# EAGLE design BLDC_Motor_Controller_ADP3120A (EAGLE 9.1.3)
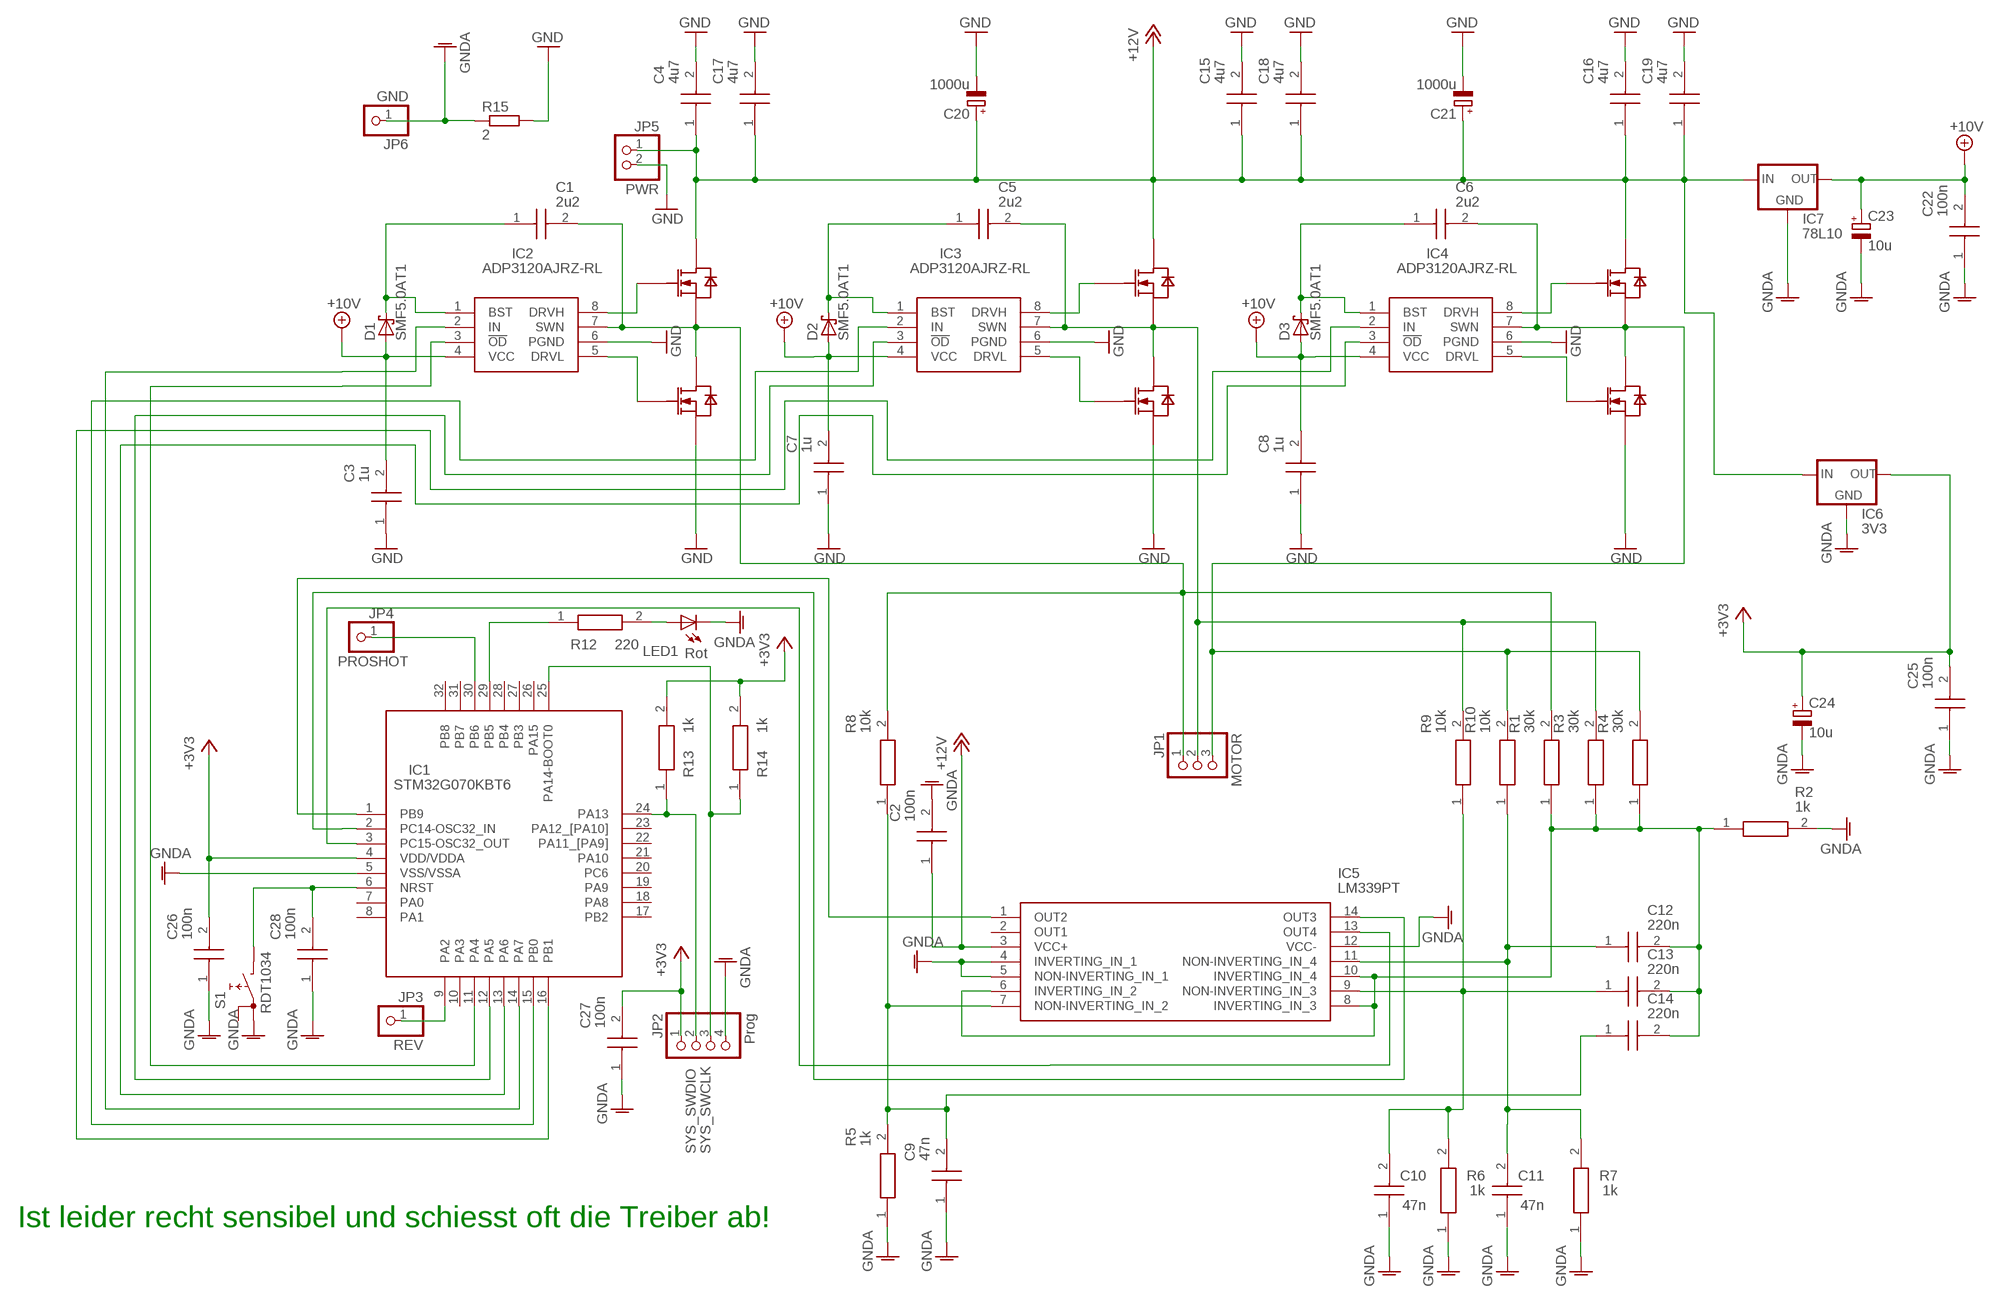
[diagram p0: schematic, sheet 1]

## Parts
C1  2u2  CL21B225KAFNNNE  [CAPC2012X135N]
C2  100n  C2012X7T2E104M125AE  [CAPC2012X145N]
C3  1u  GRM31CC72A475KE11K  [GRM31X]
C4  4u7  GRM31CC72A475KE11K  [GRM31X]
C5  2u2  CL21B225KAFNNNE  [CAPC2012X135N]
C6  2u2  CL21B225KAFNNNE  [CAPC2012X135N]
C7  1u  GRM31CC72A475KE11K  [GRM31X]
C8  1u  GRM31CC72A475KE11K  [GRM31X]
C9  47n  C2012X7T2E104M125AE  [CAPC2012X145N]
C10  47n  C2012X7T2E104M125AE  [CAPC2012X145N]
C11  47n  C2012X7T2E104M125AE  [CAPC2012X145N]
C12  220n  C2012X7T2E104M125AE  [CAPC2012X145N]
C13  220n  C2012X7T2E104M125AE  [CAPC2012X145N]
C14  220n  C2012X7T2E104M125AE  [CAPC2012X145N]
C15  4u7  GRM31CC72A475KE11K  [GRM31X]
C16  4u7  GRM31CC72A475KE11K  [GRM31X]
C17  4u7  GRM31CC72A475KE11K  [GRM31X]
C18  4u7  GRM31CC72A475KE11K  [GRM31X]
C19  4u7  GRM31CC72A475KE11K  [GRM31X]
C20  1000u  CPOL-EU150CLZ-0810  [150CLZ-0810]
C21  1000u  CPOL-EU150CLZ-0810  [150CLZ-0810]
C22  100n  C2012X7T2E104M125AE  [CAPC2012X145N]
C23  10u  CPOL-EUSMCC  [SMC_C]
C24  10u  CPOL-EUSMCC  [SMC_C]
C25  100n  C2012X7T2E104M125AE  [CAPC2012X145N]
C26  100n  C2012X7T2E104M125AE  [CAPC2012X145N]
C27  100n  C2012X7T2E104M125AE  [CAPC2012X145N]
C28  100n  C2012X7T2E104M125AE  [CAPC2012X145N]
D1  SMF5.0AT1  [SOD123FL]
D2  SMF5.0AT1  [SOD123FL]
D3  SMF5.0AT1  [SOD123FL]
IC1  STM32G070KBT6  [QFP80P900X900X160-32N]
IC2  ADP3120AJRZ-RL  [SOIC127P600X175-8N]
IC3  ADP3120AJRZ-RL  [SOIC127P600X175-8N]
IC4  ADP3120AJRZ-RL  [SOIC127P600X175-8N]
IC5  LM339PT  [SOP65P640X120-14N]
IC6  3V3  XC63FPP  [SOT89R]
IC7  78L10  XC63FPP  [SOT89R]
JP1  MOTOR  PINHD-1X3  [1X03]
JP2  Prog  PINHD-1X4  [1X04]
JP3  REV  PINHD-1X1  [1X01]
JP4  PROSHOT  PINHD-1X1  [1X01]
JP5  PWR  PINHD-1X2  [1X02]
JP6  GND  PINHD-1X1  [1X01]
LED1  Rot  LEDSML0805  [SML0805]
Q1  IRFR1205TRPBF  [TO229P991X239-3_4N]
Q2  IRFR1205TRPBF  [TO229P991X239-3_4N]
Q3  IRFR1205TRPBF  [TO229P991X239-3_4N]
Q4  IRFR1205TRPBF  [TO229P991X239-3_4N]
Q5  IRFR1205TRPBF  [TO229P991X239-3_4N]
Q6  IRFR1205TRPBF  [TO229P991X239-3_4N]
R1  30k  ERJ-UP6F1180V  [ERJUP6]
R2  1k  ERJ-UP6F1180V  [ERJUP6]
R3  30k  ERJ-UP6F1180V  [ERJUP6]
R4  30k  ERJ-UP6F1180V  [ERJUP6]
R5  1k  ERJ-UP6F1180V  [ERJUP6]
R6  1k  ERJ-UP6F1180V  [ERJUP6]
R7  1k  ERJ-UP6F1180V  [ERJUP6]
R8  10k  ERJ-UP6F1180V  [ERJUP6]
R9  10k  ERJ-UP6F1180V  [ERJUP6]
R10  10k  ERJ-UP6F1180V  [ERJUP6]
R12  220  ERJ-UP6F1180V  [ERJUP6]
R13  1k  ERJ-UP6F1180V  [ERJUP6]
R14  1k  ERJ-UP6F1180V  [ERJUP6]
R15  2  R-EU_R2012  [R2012]
S1  RDT1034  [RDT1034]

## Nets
+3V3: C24.+ C25.2 C26.2 C27.2 IC1.4(VDD/VDDA) IC6.3(OUT) JP2.1 R13.2 R14.2
+10V: C3.2 C7.2 C8.2 C22.2 C23.+ D1.A D2.A D3.A IC2.4(VCC) IC3.4(VCC) IC4.4(VCC) IC7.3(OUT)
+12V: C2.1 C4.1 C15.1 C16.1 C17.1 C18.1 C19.1 C20.+ C21.+ IC5.3(VCC+) IC6.2(IN) IC7.2(IN) JP5.1 Q1.4(DRAIN) Q3.4(DRAIN) Q5.4(DRAIN)
BEMF_U: C9.2 C14.1 IC5.7(NON-INVERTING_IN_2) R5.2 R8.1
BEMV_GND: C12.2 C13.2 C14.2 IC5.6(INVERTING_IN_2) IC5.8(INVERTING_IN_3) IC5.10(INVERTING_IN_4) R1.1 R2.1 R3.1 R4.1
BEMV_V: C10.2 C13.1 IC5.9(NON-INVERTING_IN_3) R6.2 R9.1
BEMV_W: C11.2 C12.1 IC5.11(NON-INVERTING_IN_4) R7.2 R10.1
GND: C3.1 C4.2 C7.1 C8.1 C15.2 C16.2 C17.2 C18.2 C19.2 C20.- C21.- IC2.6(PGND) IC3.6(PGND) IC4.6(PGND) JP5.2 Q2.3(SOURCE) Q4.3(SOURCE) Q6.3(SOURCE) R15.2
GNDA: C2.2 C9.1 C10.1 C11.1 C22.1 C23.- C24.- C25.1 C26.1 C27.1 C28.1 IC1.5(VSS/VSSA) IC5.4(INVERTING_IN_1) IC5.5(NON-INVERTING_IN_1) IC5.12(VCC-) IC6.1(GND) IC7.1(GND) JP2.4 JP6.1 LED1.C R2.2 R5.1 R6.1 R7.1 R15.1 S1.A1
IN_U: IC1.14(PA7) IC2.2(IN)
IN_V: IC1.15(PB0) IC3.2(IN)
IN_W: IC1.16(PB1) IC4.2(IN)
N$3: LED1.A R12.2
N$5: IC3.8(DRVH) Q3.1(GATE)
N$6: IC3.5(DRVL) Q4.1(GATE)
N$7: IC2.8(DRVH) Q1.1(GATE)
N$8: IC2.5(DRVL) Q2.1(GATE)
N$9: IC4.8(DRVH) Q5.1(GATE)
N$10: IC4.5(DRVL) Q6.1(GATE)
N$13: C1.1 D1.C IC2.1(BST)
N$14: IC1.29(PB5) R12.1
N$17: C5.1 D2.C IC3.1(BST)
N$18: IC1.9(PA2) JP3.1
N$19: C6.1 D3.C IC4.1(BST)
N$25: IC1.2(PC14-OSC32_IN) IC5.14(OUT3)
N$26: C28.2 IC1.6(NRST) S1.B
N$27: IC1.1(PB9) IC5.1(OUT2)
N$29: IC1.3(PC15-OSC32_OUT) IC5.13(OUT4)
N$31: IC1.30(PB6) JP4.1
OD_U: IC1.11(PA4) IC2.3(!OD)
OD_V: IC1.12(PA5) IC3.3(!OD)
OD_W: IC1.13(PA6) IC4.3(!OD)
SYS_SWCLK: IC1.25(PA14-BOOT0) JP2.3 R14.1
SYS_SWDIO: IC1.24(PA13) JP2.2 R13.1
U: C1.2 IC2.7(SWN) JP1.1 Q1.3(SOURCE) Q2.4(DRAIN) R1.2 R8.2
V: C5.2 IC3.7(SWN) JP1.2 Q3.3(SOURCE) Q4.4(DRAIN) R3.2 R9.2
W: C6.2 IC4.7(SWN) JP1.3 Q5.3(SOURCE) Q6.4(DRAIN) R4.2 R10.2
Unconnected: IC1.7(PA0) IC1.8(PA1) IC1.10(PA3) IC1.17(PB2) IC1.18(PA8) IC1.19(PA9) IC1.20(PC6) IC1.21(PA10) IC1.22(PA11_[PA9]) IC1.23(PA12_[PA10]) IC1.26(PA15) IC1.27(PB3) IC1.28(PB4) IC1.31(PB7) IC1.32(PB8) IC5.2(OUT1) S1.A

## Notes on the sheet
- Ist leider recht sensibel und schiesst oft die Treiber ab!

## Library data of the parts
C1 C5 C6 = SamacSys_Parts:CL21B225KAFNNNE: Multilayer Ceramic Capacitors MLCC - SMD/SMT Source: Datasheet <https://datasheet.datasheetarchive.com/originals/distributors/Datasheets_SAMA/ca4cf5b380bdfbb19a7117d5cd03bc0d.pdf>; DESCRIPTION: Multilayer Ceramic Capacitors MLCC - SMD/SMT; HEIGHT: 1.35mm; MANUFACTURER_NAME: SAMSUNG; MANUFACTURER_PART_NUMBER: CL21B225KAFNNNE; MOUSER_PART_NUMBER: 187-CL21B225KAFNNNE; MOUSER_PRICE-STOCK: https://www.mouser.co.uk/ProductDetail/Samsung-Electro-Mechanics/CL21B225KAFNNNE?qs=PPfjzIQ%252BipRYUTZ31NBO%252Bg%3D%3D
C2 C9-C14 C22 C25-C28 = SamacSys_Parts:C2012X7T2E104M125AE: TDK 0805 C 100nF Ceramic Multilayer Capacitor, 250 V dc, +125C, X7T Dielectric, +/-20% Source: Datasheet <https://product.tdk.com/info/en/catalog/datasheets/mlcc_commercial_midvoltage_en.pdf>; DESCRIPTION: TDK 0805 C 100nF Ceramic Multilayer Capacitor, 250 V dc, +125C, X7T Dielectric, +/-20%; HEIGHT: 1.45mm; MANUFACTURER_NAME: TDK; MANUFACTURER_PART_NUMBER: C2012X7T2E104M125AE; MOUSER_PART_NUMBER: 810-C2012X7T2E104MST; MOUSER_PRICE-STOCK: https://www.mouser.co.uk/ProductDetail/TDK/C2012X7T2E104M125AE?qs=LcTL%2F5vFEzEBl%252BBNoexy6w%3D%3D
C3 C7 C8 = SamacSys_Parts:GRM31CC72A475KE11K: MLCC, 1206 Source: Datasheet <https://search.murata.co.jp/Ceramy/image/img/A01X/G101/ENG/GRM31CC72A475KE11-01A.pdf>; DESCRIPTION: MLCC, 1206; HEIGHT: 1.15mm; MANUFACTURER_NAME: Murata Electronics; MANUFACTURER_PART_NUMBER: GRM31CC72A475KE11K; MOUSER_PART_NUMBER: 81-GRM31CC72A475KE1K; MOUSER_PRICE-STOCK: https://www.mouser.co.uk/ProductDetail/Murata-Electronics/GRM31CC72A475KE11K?qs=d0WKAl%252BL4KaOKvbzjRPpKw%3D%3D
C4 C15-C19 = GRM31CC72A475KE11K:GRM31CC72A475KE11K: MLCC, 1206 Source: Datasheet <https://search.murata.co.jp/Ceramy/image/img/A01X/G101/ENG/GRM31CC72A475KE11-01A.pdf>; DESCRIPTION: MLCC, 1206; HEIGHT: 1.15mm; MANUFACTURER_NAME: Murata Electronics; MANUFACTURER_PART_NUMBER: GRM31CC72A475KE11K; MOUSER_PART_NUMBER: 81-GRM31CC72A475KE1K; MOUSER_PRICE-STOCK: https://www.mouser.co.uk/ProductDetail/Murata-Electronics/GRM31CC72A475KE11K?qs=d0WKAl%252BL4KaOKvbzjRPpKw%3D%3D
C20 C21 C23 C24 = rcl:CPOL-EU: POLARIZED CAPACITOR, European symbol; SPICEPREFIX: C
D1-D3 = diode:SMF5.0AT1: 200 W Transient Voltage Suppressor Source: Data sheet <http://www.onsemi.com/pub_link/Collateral/SMF5.0AT1-D.PDF>
IC1 = SamacSys_Parts:STM32G070KBT6: 32-bit Microcontrollers - MCU Arm Cortex -M0+ 32-bit MCU, 128 KB Flash, 36 KB RAM, 4x USART, timers, ADC, comm. I/Fs, 2.0-3.6V Source: Datasheet; DESCRIPTION: 32-bit Microcontrollers - MCU Arm Cortex -M0+ 32-bit MCU, 128 KB Flash, 36 KB RAM, 4x USART, timers, ADC, comm. I/Fs, 2.0-3.6V; HEIGHT: 1.6mm; MANUFACTURER_NAME: STMicroelectronics; MANUFACTURER_PART_NUMBER: STM32G070KBT6; MOUSER_PART_NUMBER: 511-STM32G070KBT6; MOUSER_PRICE-STOCK: https://www.mouser.co.uk/ProductDetail/STMicroelectronics/STM32G070KBT6?qs=l7cgNqFNU1hmGcXjKEot4A%3D%3D
IC2-IC4 = SamacSys_Parts:ADP3120AJRZ-RL: Source: Datasheet <http://www.onsemi.com/pub/Collateral/ADP3120A-D.PDF>; HEIGHT: 1.75mm; MANUFACTURER_NAME: onsemi; MANUFACTURER_PART_NUMBER: ADP3120AJRZ-RL; MOUSER_PART_NUMBER: 863-ADP3120AJRZ-RL; MOUSER_PRICE-STOCK: https://www.mouser.co.uk/ProductDetail/onsemi/ADP3120AJRZ-RL?qs=t2BMfLoP1KShjtyDF4wdCg%3D%3D
IC5 = SamacSys_Parts:LM339PT: LM339PT,Voltage comparator,quad,TSSOP14 STMicroelectronics LM339PT Quad Comparator, CMOS/TTL O/P, 1.3us 2 36 V 14-Pin TSSOP Source: Datasheet <http://www.st.com/web/en/resource/technical/document/datasheet/CD00000460.pdf>; DESCRIPTION: LM339PT,Voltage comparator,quad,TSSOP14 STMicroelectronics LM339PT Quad Comparator, CMOS/TTL O/P, 1.3us 2 36 V 14-Pin TSSOP; HEIGHT: 1.2mm; MANUFACTURER_NAME: STMicroelectronics; MANUFACTURER_PART_NUMBER: LM339PT; MOUSER_PART_NUMBER: 511-LM339P; MOUSER_PRICE-STOCK: https://www.mouser.co.uk/ProductDetail/STMicroelectronics/LM339PT?qs=qY7WzS0PiaebXCzOp7NP%2FA%3D%3D
IC6 IC7 = v-reg:XC63FP: Positiv Voltage Regulators www.torex.co.jp/english/product/pro02/pdf/0201_xc62fp.pdf
JP1 = pinhead:PINHD-1X3: PIN HEADER
JP2 = pinhead:PINHD-1X4: PIN HEADER
JP3 JP4 JP6 = pinhead:PINHD-1X1: PIN HEADER
JP5 = pinhead:PINHD-1X2: PIN HEADER
LED1 = led:LED: LED OSRAM: - CHIPLED LG R971, LG N971, LY N971, LG Q971, LY Q971, LO R971, LY R971 LH N974, LH R974 LS Q976, LO Q976, LY Q976 LO Q996 - Hyper CHIPLED LW Q18S LB Q993, LB Q99A, LB R99A - SideLED LS A670, LO A670, LY A670, LG A670, LP A670 LB A673, LV A673, LT A673, LW A673 LH A674 LY A675 LS A676, LA A676, LO A676, LY A676, LW A676 LS A679, LY A679, LG A679 - Hyper Micro SIDELED® LS Y876, LA Y876, LO Y876, LY Y876 LT Y87S - SmartLED LW L88C, LW L88S LB L89C, LB L89S, LG L890 LS L89K, LO L89K, LY L89K LS L896, LA L896, LO L896, LY L896 - TOPLED LS T670, LO T670, LY T670, LG T670, LP T670 LSG T670, LSP T670, LSY T670, LOP T670, LYG T670 LG T671, LOG T671, LSG T671 LB T673, LV T673, LT T673, LW T673 LH T674 LS T676, LA T676, LO T676, LY T676, LB T676, LH T676, LSB T676, LW T676 LB T67C, LV T67C, LT T67C, LS T67K, LO T67K, LY T67K, LW E67C LS E67B, LA E67B, LO E67B, LY E67B, LB E67C, LV E67C, LT E67C LW T67C LS T679, LY T679, LG T679 LS T770, LO T770, LY T770, LG T770, LP T770 LB T773, LV T773, LT T773, LW T773 LH T774 LS E675, LA E675, LY E675, LS T675 LS T776, LA T776, LO T776, LY T776, LB T776 LHGB T686 LT T68C, LB T68C - Hyper Mini TOPLED® LB M676 - Mini TOPLED Santana® LG M470 LS M47K, LO M47K, LY M47K Source: http://www.osram.convergy.de LUXEON: - LUMILED® LXK2-PW12-R00, LXK2-PW12-S00, LXK2-PW14-U00, LXK2-PW14-V00 LXK2-PM12-R00, LXK2-PM12-S00, LXK2-PM14-U00 LXK2-PE12-Q00, LXK2-PE12-R00, LXK2-PE12-S00, LXK2-PE14-T00, LXK2-PE14-U00 LXK2-PB12-K00, LXK2-PB12-L00, LXK2-PB12-M00, LXK2-PB14-N00, LXK2-PB14-P00, LXK2-PB14-Q00 LXK2-PR12-L00, LXK2-PR12-M00, LXK2-PR14-Q00, LXK2-PR14-R00 LXK2-PD12-Q00, LXK2-PD12-R00, LXK2-PD12-S00 LXK2-PH12-R00, LXK2-PH12-S00 LXK2-PL12-P00, LXK2-PL12-Q00, LXK2-PL12-R00 Source: www.luxeon.com KINGBRIGHT: KA-3528ASYC Source: www.kingbright.com
Q1-Q6 = IRFR1205TRPBF:IRFR1205TRPBF: IRFR1205TRPBF HEXFET Power MOSFET VDSS=-100V, ID=-13A TO229P991X239-3_4N
R1-R10 R12-R14 = SamacSys_Parts:ERJ-UP6F1180V: Anti-Sulfurated Thick Film Chip Resistors/ Anti-Surge Type, Power Rating (W): 0.5, Chip Size (LxW(EIA)) (mm): 2.0 x 1.25 (EIA:0805), Resistance Values (?): 118, Resistance Tolerance (%): 1, T.C.R (?102/K): ?100 Source: Datasheet <https://industrial.panasonic.com/cdbs/www-data/pdf/RDP0000/AOA0000C337.pdf>; DESCRIPTION: Anti-Sulfurated Thick Film Chip Resistors/ Anti-Surge Type, Power Rating (W): 0.5, Chip Size (LxW(EIA)) (mm): 2.0 x 1.25 (EIA:0805), Resistance Values (?): 118, Resistance Tolerance (%): 1, T.C.R (?102/K): ?100; HEIGHT: 0.7mm; MANUFACTURER_NAME: Panasonic; MANUFACTURER_PART_NUMBER: ERJ-UP6F1180V
R15 = rcl:R-EU_: RESISTOR, European symbol; SPICEPREFIX: R
S1 = switch:RDT1034: PUSH SWITCH www.radiohm.com

## Board
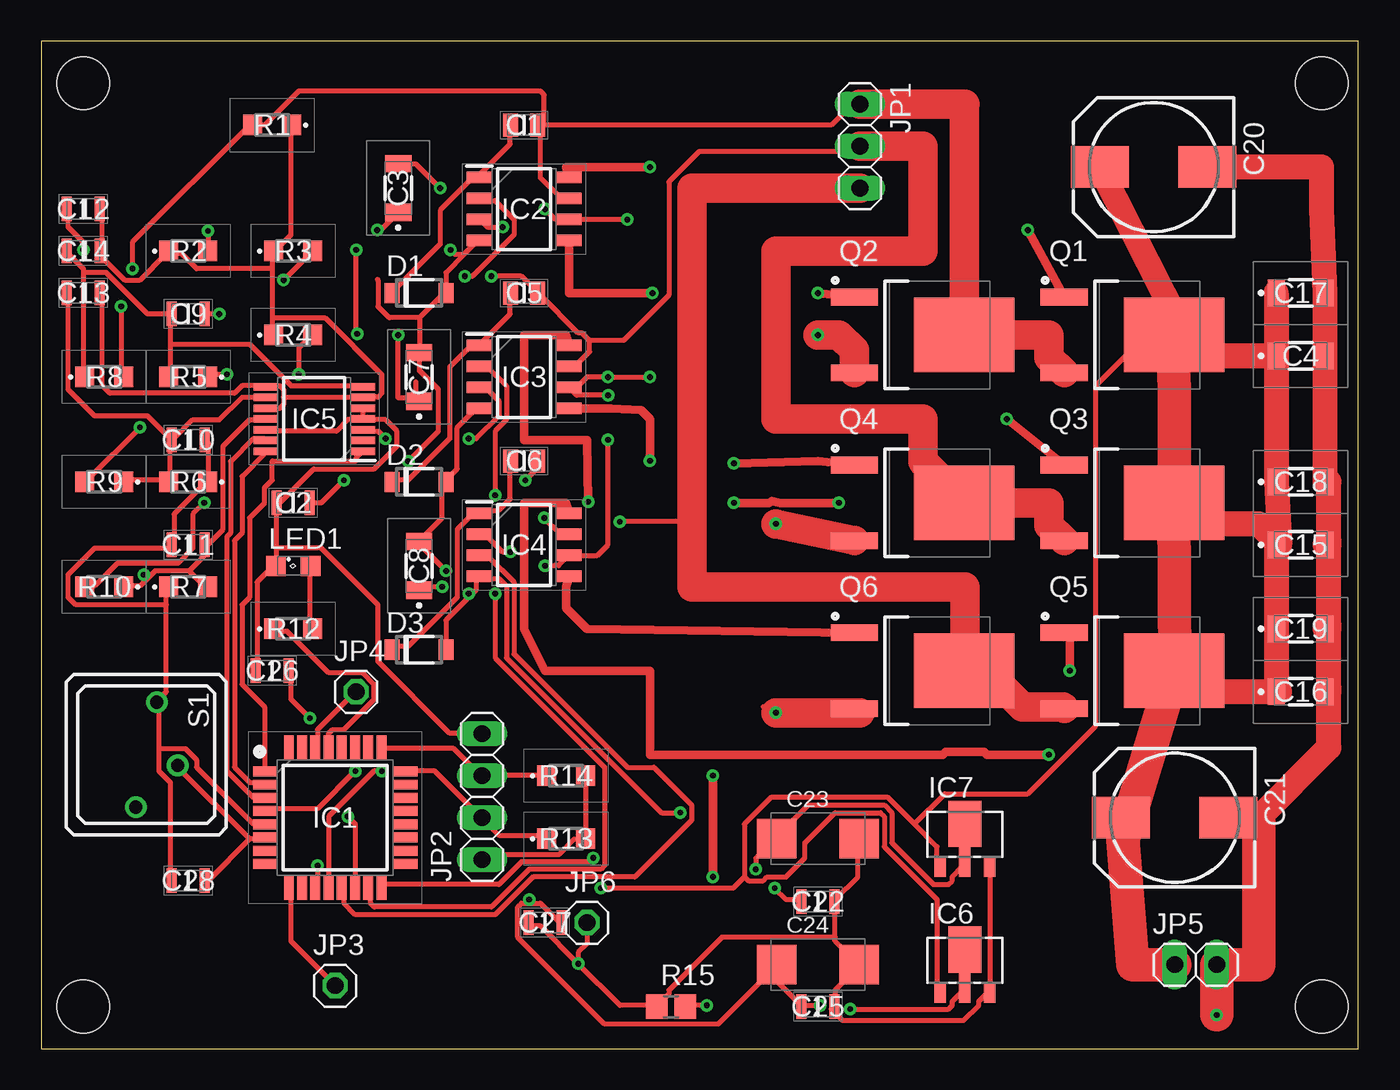
[diagram p1: board, top side]
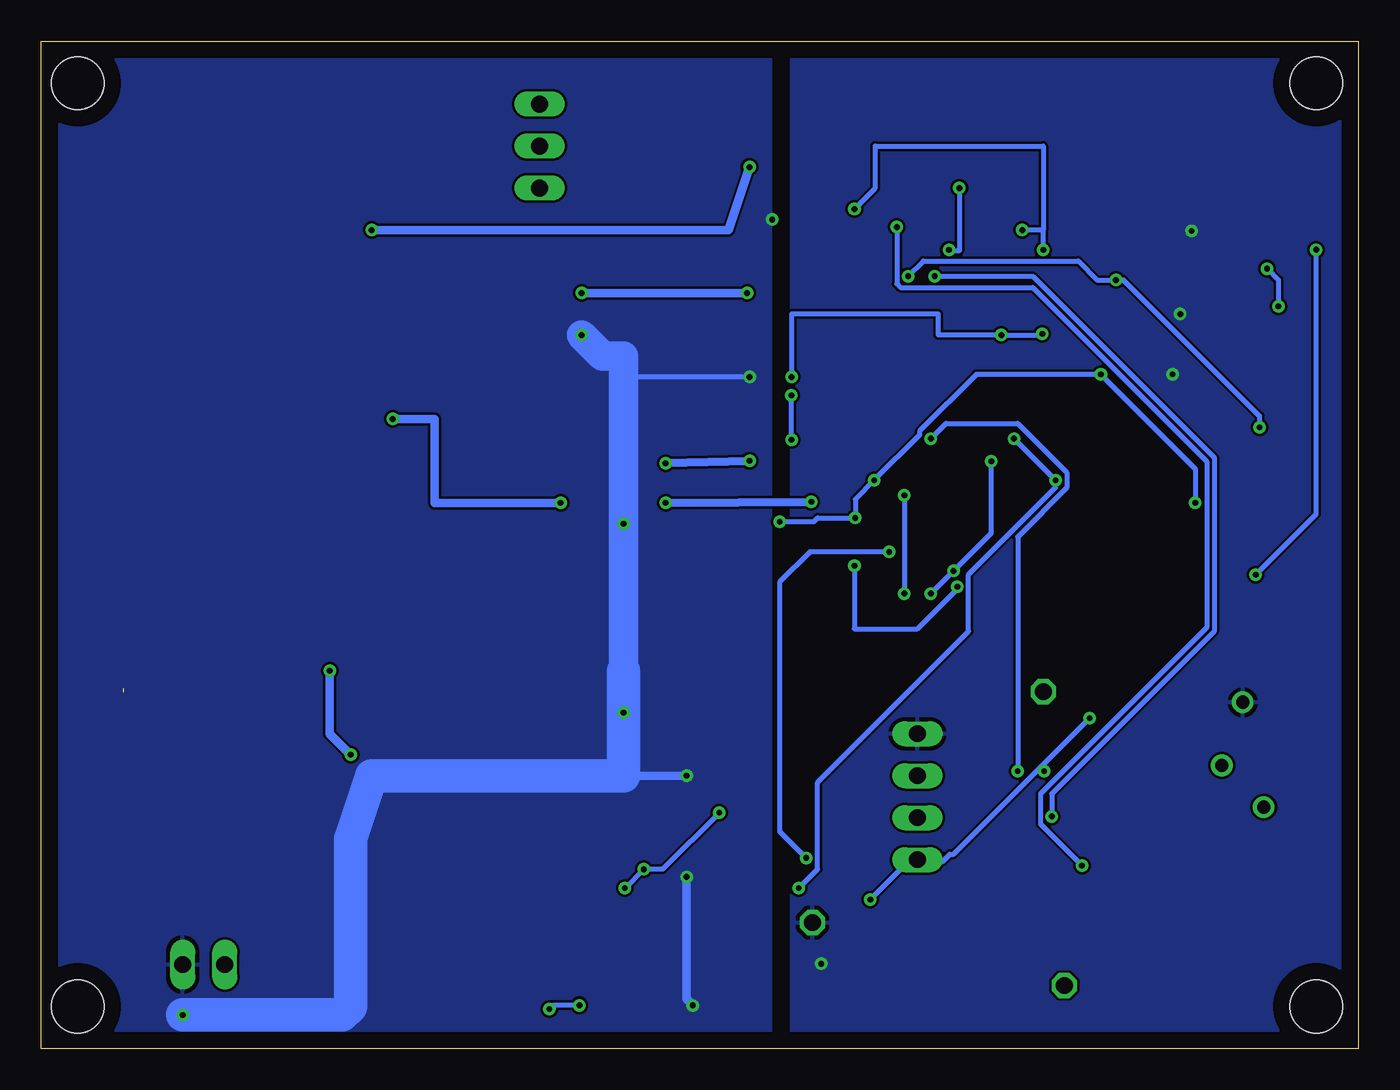
[diagram p2: board, bottom side, seen from below]

Size 79.68 x 60.95 mm. Coordinates in mm from the lower left corner, seen from the top.
Outline: 0,0 79.68,0 79.68,60.95 0,60.95 0,0
Copper layers (1*16): Top 0.035mm / dielectric 1.5mm / Bottom 0.035mm
Design rules "default *": minimum track width 12mil, minimum drill 0.35mm, track to track 6mil, track to pad 6mil, pad to pad 6mil, via to via 6mil, smd to smd 6mil, copper to edge 40mil, drill to drill 6mil, minimum pad ring 10mil, minimum via ring 8mil, stop-mask expansion 4mil, vias tented up to drill 0mil, thermal gap 10mil
Holes 3.17 mm at 2.54,58.42 2.54,2.54 77.47,2.54 77.47,58.42

### Footprints (pad centres in the part's own frame; a part is rotated, then mirrored left to right if it is on the bottom)
CAPC2012X135N = smd 0.91 x 1.39: 1 -0.82,0; 2 0.82,0
CAPC2012X145N = smd 0.62 x 1.47: 1 -1,0; 2 1,0
GRM31X = smd 1.05 x 1.6: 1 -1.475,0; 2 1.475,0
150CLZ-0810 = smd 3.5 x 2.5: + 3.25,0; - -3.25,0
SMC_C = smd 2.4 x 2.4: + -2.5,0; - 2.5,0
SOD123FL = smd 0.91 x 1.22: A 1.625,0; C -1.625,0
QFP80P900X900X160-32N = smd 1.475 x 0.6: 1 -4.238,2.8; 2 -4.238,2; 3 -4.238,1.2; 4 -4.238,0.4; 5 -4.238,-0.4; 6 -4.238,-1.2; 7 -4.238,-2; 8 -4.238,-2.8; 17 4.238,-2.8; 18 4.238,-2; 19 4.238,-1.2; 20 4.238,-0.4; 21 4.238,0.4; 22 4.238,1.2; 23 4.238,2; 24 4.238,2.8 | smd 0.6 x 1.475: 9 -2.8,-4.238; 10 -2,-4.238; 11 -1.2,-4.238; 12 -0.4,-4.238; 13 0.4,-4.238; 14 1.2,-4.238; 15 2,-4.238; 16 2.8,-4.238; 25 2.8,4.238; 26 2,4.238; 27 1.2,4.238; 28 0.4,4.238; 29 -0.4,4.238; 30 -1.2,4.238; 31 -2,4.238; 32 -2.8,4.238
SOIC127P600X175-8N = smd 1.525 x 0.7: 1 -2.712,1.905; 2 -2.712,0.635; 3 -2.712,-0.635; 4 -2.712,-1.905; 5 2.712,-1.905; 6 2.712,-0.635; 7 2.712,0.635; 8 2.712,1.905
SOP65P640X120-14N = smd 1.475 x 0.45: 1 -2.938,1.95; 2 -2.938,1.3; 3 -2.938,0.65; 4 -2.938,0; 5 -2.938,-0.65; 6 -2.938,-1.3; 7 -2.938,-1.95; 8 2.938,-1.95; 9 2.938,-1.3; 10 2.938,-0.65; 11 2.938,0; 12 2.938,0.65; 13 2.938,1.3; 14 2.938,1.95
SOT89R = smd 0.7 x 1.1: 1 1.5,-1.75; 2 -1.5,-1.75 | smd 0.7 x 1.8: 3 0,-1.4 | smd 2 x 2.8: 4 0,0.9
1X03 = drill 1.016 long: 1 -2.54,0; 2 0,0; 3 2.54,0
1X04 = drill 1.016 long: 1 -3.81,0; 2 -1.27,0; 3 1.27,0; 4 3.81,0
1X01 = drill 1.016 octagon: 1 0,0
1X02 = drill 1.016 long: 1 -1.27,0; 2 1.27,0
SML0805 = smd 1.2 x 1.2: A 1.05,0; C -1.05,0
TO229P991X239-3_4N = smd 2.85 x 1: 1 -4.15,2.29; 3 -4.15,-2.29 | smd 6.1 x 4.5: 4 2.5,0
ERJUP6 = smd 1.15 x 1.25: 1 -1.175,0; 2 1.175,0
R2012 = smd 1.3 x 1.5: 1 -0.85,0; 2 0.85,0
RDT1034 = drill 0.8: A 3.175,-0.635; A1 -3.175,0.635; B 0.65,1.9

### Placement (x,y rotation side)
C1  29.21,55.88 0 top
C2  15.24,33.02 180 top
C3  21.59,52.07 90 top
C4  76.2,41.91 0 top
C5  29.21,45.72 0 top
C6  29.21,35.56 0 top
C7  22.86,40.64 90 top
C8  22.86,29.21 90 top
C9  8.89,44.45 180 top
C10  8.89,36.83 180 top
C11  8.89,30.48 0 top
C12  2.54,50.8 0 top
C13  2.54,45.72 0 top
C14  2.54,48.26 0 top
C15  76.2,30.48 0 top
C16  76.2,21.59 0 top
C17  76.2,45.72 0 top
C18  76.2,34.29 0 top
C19  76.2,25.4 0 top
C20  67.31,53.34 180 top
C21  68.58,13.97 180 top
C22  46.99,8.89 180 top
C23  46.99,12.7 0 top
C24  46.99,5.08 0 top
C25  46.99,2.54 180 top
C26  13.97,22.86 0 top
C27  30.48,7.62 0 top
C28  8.89,10.16 0 top
D1  22.86,45.72 0 top
D2  22.86,34.29 0 top
D3  22.86,24.13 0 top
IC1  17.78,13.97 0 top
IC2  29.21,50.8 0 top
IC3  29.21,40.64 0 top
IC4  29.21,30.48 0 top
IC5  16.51,38.1 180 top
IC6  55.88,5.08 0 top
IC7  55.88,12.7 0 top
JP1  49.53,54.61 270 top
JP2  26.67,15.24 90 top
JP3  17.78,3.81 0 top
JP4  19.05,21.59 0 top
JP5  69.85,5.08 0 top
JP6  33.02,7.62 0 top
LED1  15.24,29.21 0 top
Q1  66.04,43.18 0 top
Q2  53.34,43.18 0 top
Q3  66.04,33.02 0 top
Q4  53.34,33.02 0 top
Q5  66.04,22.86 0 top
Q6  53.34,22.86 0 top
R1  13.97,55.88 180 top
R2  8.89,48.26 0 top
R3  15.24,48.26 0 top
R4  15.24,43.18 0 top
R5  8.89,40.64 180 top
R6  8.89,34.29 180 top
R7  8.89,27.94 0 top
R8  3.81,40.64 0 top
R9  3.81,34.29 180 top
R10  3.81,27.94 180 top
R12  15.24,25.4 0 top
R13  31.75,12.7 0 top
R14  31.75,16.51 0 top
R15  38.1,2.54 0 top
S1  6.35,17.78 270 top

### Tracks (layer width: path | path; a pad name or v marks a point on that pad's centre or on a via)
+3V3  (via drill 0.35)
  Top 0.305: 29.52,8.79 29.06,8.79 28.83,8.56 28.83,6.73 34.09,1.47 40.95,1.47 43.92,4.45 | 29.52,8.79 30.2,8.79 31.34,7.64 C27.2 | 43.92,4.45 44.37,4.9 C24.+ 43.92,4.45 | 43.92,4.45 44.15,4.45 45.97,2.62 C25.2 46.2,2.62 v47.12,2.62 | v48.95,2.39 54.89,2.39 55.12,2.62 55.12,2.85 55.8,3.53 IC6.3 | R14.2 32.94,16.33 32.94,12.9 R13.2 32.71,12.68 32.26,12.68 31.34,11.76 27,11.76 JP2.1 | v16.26,19.99 15.11,21.13 15.11,22.73 C26.2 | v19,16.79 16.71,14.5 13.74,14.5 IC1.4 | v29.52,9.02 29.52,8.79
  Bottom 0.305: v48.95,2.39 48.72,2.62 v47.12,2.62 | 19.23,17.02 24.49,11.76 24.71,11.76 25.17,11.3 26.54,11.3 JP2.1 26.77,11.3 27.23,11.3 v29.52,9.02 | 19.23,17.02 v16.26,19.99 | 19.23,17.02 v19,16.79
+10V  (via drill 0.35)
  Top 0.305: v44.37,9.7 45.06,9.02 45.97,9.02 C22.2 | v43.23,10.85 43.23,11.53 44.37,12.68 C23.+ 44.6,12.9 46.43,14.73 51,14.73 51.46,14.28 51.46,12.45 53.98,9.93 54.89,9.93 55.12,10.16 55.12,10.39 55.8,11.07 IC7.3 | 25.59,48.07 26.31,48.79 IC2.4 26.15,48.89 | 25.59,48.07 24.49,46.97 24.49,45.82 D1.A 24.26,45.59 22.88,44.22 | 22.88,44.22 22.88,42.16 C7.2 22.88,41.94 22.88,41.02 24.03,39.88 24.03,37.36 v22.2,35.53 | 22.88,44.22 21.06,44.22 20.37,44.91 20.37,46.51 20.32,46.56 | 25.86,27.31 26.31,27.76 26.31,28.45 IC4.4 26.54,28.45 27.69,28.45 28.14,27.99 28.14,23.65 37.52,14.28 v38.66,14.28 | 25.86,27.31 24.49,25.93 24.49,24.33 D3.A | IC3.4 26.31,38.73 25.17,37.59 25.17,35.08 24.49,34.39 D2.A 24.26,34.16 24.26,32.11 22.88,30.73 C8.2 22.88,30.5 v24.49,28.9 | v25.86,27.53 25.86,27.31 | 21.38,53.34 C3.2 22.66,53.55 v24.13,52.07 | v24.76,48.33 25.03,48.07 25.59,48.07
  Bottom 0.305: v44.37,9.7 v43.23,10.85 42.09,10.85 v38.66,14.28 | v25.86,27.53 v24.49,28.9 22.2,31.19 v22.2,35.53 | v24.76,48.33 24.69,48.26 24.13,48.26 v24.13,52.07
+12V  (via drill 0.35)  (1 unrouted)
  Top 0.305: C2.1 16.94,33.02 v18.31,34.39 | v20.83,36.91 20.37,37.36 19.46,37.36 IC5.3 | 42.55,10.39 42.77,10.16 43.69,10.16 43.92,10.39 45.06,10.39 46.2,11.53 46.2,12.45 48.03,14.28 50.77,14.28 51,14.05 51,12.22 54.2,9.02 54.2,3.53 IC6.2 | 42.55,10.39 42.55,13.59 44.15,15.19 51.23,15.19 52.83,13.59 | 52.83,13.59 54.2,12.22 54.2,11.07 IC7.2 | v33.86,9.7 41.86,9.7 42.55,10.39 | 52.83,13.59 54.66,15.42 59.69,15.42 63.8,19.53 63.8,40.11 67.92,44.22 Q1.4
  Top 1.524: C20.+ 69.85,41.91 C4.1 | C17.1 C4.1 | C15.1 74.93,30.48 C18.1 C4.1 | C15.1 74.72,30.68 73.66,31.75 68.58,31.75 | C15.1 C19.1 74.72,21.79 74.93,21.59 67.31,21.59 67.31,22.86 68.58,22.86
  Top 2.032: C21.+ 65.44,12.65 | 65.44,12.65 66.04,5.08 JP5.1 | Q1.4 68.58,31.75 Q3.4 68.58,22.86 Q5.4 65.44,12.65
  Bottom 0.305: v20.83,36.91 v18.31,34.39 18.31,33.93 23.57,28.68 23.57,25.25 32.71,16.1 32.71,10.85 v33.86,9.7
BEMF_U
  Top 0.305: 2.54,46.97 2.54,47.19 1.63,48.11 C14.1 | 2.54,46.97 2.54,40.79 R8.1 | 7.8,44.45 7.8,42.62 | 7.8,42.62 7.8,40.79 R5.2 | 7.8,42.62 12.6,42.62 15.11,40.11 19.23,40.11 IC5.7 | 2.54,46.97 3.91,46.97 6.43,44.45 7.8,44.45 | 7.8,44.45 C9.2
BEMV_GND
  Top 0.305: C13.2 3.68,45.59 3.68,40.11 4.14,39.65 11.68,39.65 12.14,40.11 13.51,40.11 IC5.8 13.74,40.11 14.43,40.11 14.66,39.88 14.66,39.42 | 14.66,39.42 14.66,38.96 14.43,38.73 13.74,38.73 IC5.10 | 14.66,39.42 19.23,39.42 IC5.6 19.46,39.42 20.37,39.42 20.6,39.65 20.6,40.79 17.17,44.22 13.97,44.22 | C12.2 3.68,50.62 3.68,48.34 C14.2 3.45,48.11 5.05,46.51 5.97,46.51 7.57,48.11 R2.1 7.8,48.11 8.48,48.11 9.4,47.19 13.97,47.19 | 13.97,47.19 13.97,48.11 R3.1 14.2,48.34 15.11,49.25 15.11,55.88 R1.1 | 13.97,47.19 13.97,44.22 | 13.97,44.22 13.97,43.31 R4.1
BEMV_V
  Top 0.305: R9.1 5.05,34.39 7.57,34.39 R6.2 7.8,34.39 7.8,36.68 C10.2 | C13.1 1.63,45.59 1.63,39.88 3.23,38.28 6.43,38.28 7.8,36.91 C10.2 | IC5.9 13.51,39.42 12.14,39.42 10.77,38.05 9.17,38.05 8.03,36.91 C10.2
BEMV_W  (via drill 0.35)
  Top 0.305: 6.43,28.45 6.88,28.9 8.94,28.9 | 6.43,28.45 5.97,27.99 5.05,27.99 R10.1 | 8.94,28.9 9.86,27.99 R7.2 | v2.54,48.34 2.54,48.79 1.63,49.71 1.63,50.62 C12.1 | 6.43,28.45 v6.2,28.68 | 8.94,28.9 9.86,29.82 9.86,30.28 C11.2 10.08,30.5 11,31.42 11,36.45 12.6,38.05 13.51,38.05 IC5.11
  Bottom 0.305: v2.54,48.34 2.54,32.33 v6.2,28.68
GND  (via drill 0.35)
  Top 0.305: 22.66,40.33 22.66,39.19 C7.1 22.66,39.37 21.59,39.37 v21.59,43.18 | 32.49,30.05 32.03,30.05 IC4.6 | 31.34,39.88 31.8,39.88 IC3.6 | v40.26,2.62 39.12,2.62 R15.2 | v35.46,50.17 IC2.6 31.12,50.17 v30.48,50.8 | 22.88,27.76 C8.1 23.06,27.94 v24.25,27.94 | Q6.3 49.17,20.68 49.17,20.32 | C21.- 71.81,14.05 71.81,13.97 | 31.8,29.82 IC4.6 | 43.69,20.68 v44.45,20.32 | C16.2 77.9,21.59 | v20.32,49.53 20.52,49.53 C3.1 | IC3.6 32.38,40 33.02,40.64 v34.29,40.64 v36.83,40.64 | IC4.6 31.31,29.23 31.03,29.23 31.01,29.21 v30.48,29.21 | v19.11,43.24 19.05,43.31 v19.05,48.33 | IC4.6 33.66,29.85 34.29,30.48 v34.29,36.83 | v34.3,39.53 32.4,39.53 IC3.6
  Top 0.508: v40.64,10.39 v40.64,16.51
  Top 1.524: 77.9,21.59 77.9,18.21 73.66,13.97 | C16.2 77.9,21.82 77.9,25.4 C19.2 77.9,25.63 77.9,30.48 C15.2 77.9,30.71 77.9,34.29 C18.2 C4.2 C17.2 77.47,50.8 77.47,53.34 C20.-
  Top 1.778: v44.45,31.75 Q4.3 | v44.45,20.32 49.17,20.32 49.53,20.32 | v46.99,43.18 48.26,43.18 49.19,42.25 Q2.3
  Top 2.032: 71.12,13.97 71.81,13.97 C21.- 73.66,13.97 73.66,5.08 JP5.2 v71.12,2.03
  Bottom 0.305: v35.46,50.17 35.56,50.17 | v30.48,50.8 29.21,52.07 29.21,54.61 19.05,54.61 19.05,49.53 | 19.05,49.53 v20.32,49.53 | v34.29,40.64 34.29,44.45 25.4,44.45 25.4,43.18 v21.59,43.18 19.05,43.18 v19.11,43.24 | v30.48,29.21 30.48,25.4 26.67,25.4 24.13,27.94 v24.25,27.94 | v36.83,40.64 44.45,40.64 | v19.05,48.33 19.05,49.53 | v34.29,36.83 34.29,39.37 34.3,39.38 v34.3,39.53
  Bottom 0.508: v40.26,2.62 40.64,3 v40.64,10.39 | v40.64,16.51 44.45,16.51
  Bottom 1.778: v44.45,20.32 44.45,22.86 v44.45,31.75 44.45,40.64 44.45,41.91 45.72,41.91 v46.99,43.18
  Bottom 2.032: 44.45,22.86 44.45,16.51 59.69,16.51 60.96,12.7 60.96,2.54 61.47,2.03 v71.12,2.03
  pour Bottom: 35.56,53.34 35.56,0 43.18,0 80.01,0 80.01,60.96 78.74,60.96 35.56,60.96
GNDA  (via drill 0.35)
  Top 0.305: v32.49,5.13 35,2.62 37.06,2.62 R15.1 37.29,2.62 37.97,3.3 37.97,3.53 41.17,6.73 48.03,6.73 | v32.49,5.13 30.2,7.42 29.52,7.42 C27.1 | IC7.1 57.4,10.85 57.4,3.53 IC6.1 57.18,3.3 56.72,2.85 56.72,2.62 55.8,1.7 48.49,1.7 47.8,2.39 C25.1 48.03,2.62 48.03,3.53 49.4,4.9 C24.- 49.4,5.13 48.03,6.5 48.03,6.73 | 48.03,6.73 48.03,8.79 C22.1 48.03,9.02 49.4,10.39 49.4,12.68 C23.- | IC5.12 13.74,37.36 17.86,37.36 18.54,38.05 19.23,38.05 IC5.4 | IC5.5 19.46,38.73 19.46,38.28 IC5.4 | 14.2,30.28 14.2,33.02 C2.2 14.43,33.02 16.48,35.08 20.14,35.08 21.51,36.45 21.51,37.36 20.83,38.05 19.46,38.05 IC5.4 | 14.2,30.28 14.2,29.36 LED1.C 13.97,29.13 13.06,28.22 13.06,22.96 C26.1 | C10.1 10.08,36.68 10.08,34.39 R6.1 9.86,34.16 8.03,32.33 8.03,30.5 C11.1 7.8,30.28 3.23,30.28 1.63,28.68 1.63,27.31 2.08,26.85 7.57,26.85 | 7.57,26.85 7.57,21.59 7.11,21.13 S1.A1 7.11,20.9 7.11,18.16 | 7.57,26.85 7.57,27.76 R7.1 | v11.23,40.79 10.08,40.79 R5.1 | v10.08,49.48 10.08,48.34 R2.2 | 7.11,18.16 7.11,16.79 7.8,16.1 7.8,10.16 C28.1 | v10.77,44.45 C9.1 | 7.11,18.16 8.71,18.16 9.4,17.48 9.4,17.02 12.83,13.59 13.51,13.59 IC1.5 | 14.2,30.28 16.94,30.28 20.37,26.85 20.37,23.42 24.71,19.07 26.54,19.07 JP2.4 | JP6.1 33.02,6.35 32.49,5.82 v32.49,5.13
  pour Bottom: 0,60.96 34.29,60.96 34.29,0 0,0
IN_U  (via drill 0.35)
  Top 0.305: v18.54,14.05 19,13.59 19,9.93 IC1.14 | v25.63,46.74 26.09,46.74 28.6,49.25 28.6,50.17 27.46,51.31 26.54,51.31 IC2.2
  Bottom 0.305: v18.54,14.05 18.54,15.42 8.71,25.25 8.71,35.76 19.69,46.74 v25.63,46.74
IN_V  (via drill 0.35)
  Top 0.305: v27.46,27.53 27.46,23.65 34.09,17.02 34.09,11.07 33.86,10.85 29.52,10.85 27.23,8.56 20.14,8.56 19.91,8.79 19.91,9.7 IC1.15 | v27.46,33.48 27.46,37.36 28.14,38.05 28.14,40.11 27,41.25 26.54,41.25 IC3.2
  Bottom 0.305: v27.46,33.48 v27.46,27.53
IN_W  (via drill 0.35)
  Top 0.305: v33.4,11.53 33.17,11.3 29.06,11.3 27.69,9.93 20.6,9.93 IC1.16 | v28.37,30.05 27.91,30.05 27,30.96 26.54,30.96 IC4.2
  Bottom 0.305: v33.4,11.53 35,13.13 35,28.22 33.17,30.05 33.02,30.05 | v28.37,30.05 33.02,30.05 | 33.02,30.05
N$3
  Top 0.305: LED1.A 16.26,29.13 16.26,25.48 R12.2
N$5  (via drill 0.35)
  Top 0.508: Q3.1 v58.42,38.1 | v48.26,33.02 44.71,33.02 44.2,33.13 44.03,33.02 v41.91,33.02 | v33.09,33.08 33.02,36.83 29.21,36.83 29.21,43.18 31.75,43.18 IC3.8
  Bottom 0.508: v58.42,38.1 55.88,38.1 55.88,33.02 v48.26,33.02 | v41.91,33.02 v33.09,33.08
N$6  (via drill 0.35)
  Top 0.508: Q4.1 46.99,35.56 v41.91,35.41 | IC3.5 34.46,38.73 36.29,38.64 36.83,38.1 v36.83,35.56
  Bottom 0.508: v36.83,35.56 41.88,35.44 v41.91,35.41
N$7  (via drill 0.35)
  Top 0.508: Q1.1 v59.69,49.53 | v36.83,53.34 31.75,53.34 IC2.8
  Bottom 0.508: v59.69,49.53 38.1,49.53 v36.83,53.34
N$8  (via drill 0.35)
  Top 0.508: Q2.1 v46.99,45.72 | IC2.5 31.92,45.72 v36.98,45.72
  Bottom 0.508: v46.99,45.72 v36.98,45.72
N$9  (via drill 0.35)
  Top 0.508: v60.96,17.78 57.21,17.78 57.05,17.95 54.71,17.95 54.54,17.78 36.83,17.78 36.83,22.86 30.48,22.86 29.21,25.4 29.21,33.02 31.75,33.02 IC4.8 | v62.23,22.86 62.23,24.81 Q5.1
  Bottom 0.508: v60.96,17.78 62.23,19.05 v62.23,22.86
N$10
  Top 0.508: Q6.1 33.02,25.4 31.75,26.67 31.75,27.94 IC4.5
N$13
  Top 0.305: D1.C 21.28,45.82 24.13,48.67 24.13,50.72 26.31,52.91 IC2.1 26.54,52.91 28.37,54.74 28.37,55.88 C1.1
N$14
  Top 0.305: R12.1 14.2,25.25 14.88,25.25 17.4,22.73 19.46,22.73 20.14,22.05 20.14,21.13 18.31,19.3 17.63,19.3 17.4,19.07 17.4,18.39 IC1.29
N$17
  Top 0.305: D2.C 21.28,34.39 22.2,34.39 24.71,36.91 24.71,41.25 25.86,42.39 26.31,42.39 IC3.1 26.54,42.62 28.37,44.45 28.37,45.59 C5.1
N$18
  Top 0.305: IC1.9 15.11,9.7 15.11,6.5 17.63,3.99 JP3.1
N$19
  Top 0.305: D3.C 21.28,24.33 22.2,24.33 25.17,27.31 25.17,31.42 26.31,32.56 IC4.1 26.54,32.56 27.69,32.56 28.37,33.25 28.37,35.53 C6.1
N$25
  Top 0.305: IC1.2 13.51,16.1 12.6,16.1 11.68,17.02 11.68,30.73 12.14,31.19 12.14,34.62 13.51,35.99 IC5.14
N$26
  Top 0.305: 12.6,12.68 10.08,10.16 C28.2 | 12.6,12.68 13.51,12.68 IC1.6 | 12.6,12.68 8.25,17.02 S1.B
N$27
  Top 0.305: IC1.1 13.51,16.79 13.51,20.68 12.14,22.05 12.14,26.85 12.6,27.31 12.6,32.11 13.51,33.02 13.51,33.93 13.97,34.39 13.97,35.56 19.05,35.56 19.05,35.75 IC5.1
N$29
  Top 0.305: IC1.3 13.51,15.19 12.83,15.19 11.23,16.79 11.23,30.96 11.45,31.19 11.45,35.53 12.83,36.91 13.51,36.91 IC5.13
N$31
  Top 0.305: IC1.30 16.71,18.39 16.71,19.3 19,21.59 JP4.1
OD_U  (via drill 0.35)
  Top 0.305: v16.71,11.07 16.71,9.93 IC1.11 | v27.91,49.71 27,49.71 26.54,50.17 IC2.3
  Bottom 0.305: v16.71,11.07 19.23,13.59 19.23,15.42 9.17,25.48 9.17,35.53 19.69,46.05 27.69,46.05 27.91,46.28 v27.91,49.71
OD_V  (via drill 0.35)
  Top 0.305: v20.6,16.79 20.14,16.79 17.4,14.05 17.4,9.93 IC1.12 | v25.86,36.91 26.31,36.91 27.69,38.28 27.69,39.19 27,39.88 26.54,39.88 IC3.3
  Bottom 0.305: v20.6,16.79 20.6,30.96 17.63,33.93 17.63,34.85 20.6,37.82 24.94,37.82 v25.86,36.91
OD_W
  Top 0.305: IC1.13 18.31,9.7 18.31,8.79 19,8.1 27.46,8.1 29.74,10.39 35.92,10.39 39.34,13.82 39.34,14.73 37.06,17.02 35.46,17.02 28.6,23.88 28.6,28.22 27,29.82 26.54,29.82 IC4.3
SYS_SWCLK
  Top 0.305: R14.1 30.43,16.56 26.77,16.56 JP2.3 26.54,16.56 24.94,18.16 20.6,18.16 IC1.25
SYS_SWDIO
  Top 0.305: R13.1 30.43,12.9 27.69,12.9 26.77,13.82 JP2.2 26.54,14.05 23.8,16.79 22.2,16.79 IC1.24
U  (via drill 0.35)
  Top 0.305: v4.83,44.91 4.83,40.79 R8.2 | v5.51,47.19 5.51,48.79 12.6,55.88 R1.2 13.51,55.88 15.57,57.94 30.2,57.94 30.43,57.71 30.43,55.88 | 30.2,55.88 30.2,52.68 31.34,51.54 31.8,51.54 IC2.7 | 30.43,55.88 47.8,55.88 48.72,56.79 JP1.1 | 30.43,55.88 30.2,55.88 | 30.2,55.88 C1.2 30.2,55.88
  Top 1.778: JP1.1 55.88,57.15 55.84,57.11 Q2.4 60.96,43.18 60.96,41.82 Q1.3
  Bottom 0.305: v4.83,44.91 4.83,46.51 v5.51,47.19
V  (via drill 0.35)
  Top 0.305: v5.97,37.59 2.77,34.39 R9.2 | v14.66,46.51 16.26,48.11 R3.2 | 33.17,42.85 32.71,43.31 32.49,43.31 30.2,45.59 C5.2 29.97,45.82 29.06,46.74 v27.23,46.74 | 33.17,42.85 33.17,42.16 32.49,41.48 32.03,41.48 IC3.7 | 33.17,42.85 35.23,42.85 37.97,45.59 37.97,52.45 39.8,54.28 48.72,54.28 JP1.2
  Top 1.778: JP1.2 53.34,54.61 53.34,48.26 44.45,48.26 44.45,41.91 44.45,38.1 53.34,38.1 53.34,35.52 Q4.4 60.96,33.02 60.96,31.66 Q3.3
  Bottom 0.305: v5.97,37.59 5.97,38.28 14.2,46.51 v14.66,46.51 15.8,46.51 16.94,47.65 26.31,47.65 v27.23,46.74
W  (via drill 0.35)
  Top 0.305: v9.86,33.02 9.17,32.33 9.17,30.28 8.25,29.36 4.6,29.36 3.23,27.99 2.77,27.99 R10.2 | v15.57,40.79 15.57,42.39 16.26,43.08 R4.2 | v29.29,34.39 29.97,35.08 29.97,35.53 C6.2 | v30.43,32.11 31.34,31.19 31.8,31.19 IC4.7 | 39.37,31.88 v35,31.88
  Top 1.778: JP1.3 39.37,52.07 39.37,31.88 39.37,27.94 55.88,27.94 55.88,22.9 Q6.4 57.15,22.86 59.35,20.66 61.8,20.66 Q5.3
  Bottom 0.305: v9.86,33.02 9.86,35.08 v15.57,40.79 23.11,40.79 26.54,37.36 26.54,37.14 v29.29,34.39 30.43,33.25 v30.43,32.11 32.71,32.11 32.94,31.88 v35,31.88